# EAGLE design DualMax485 (EAGLE 9.6.2)
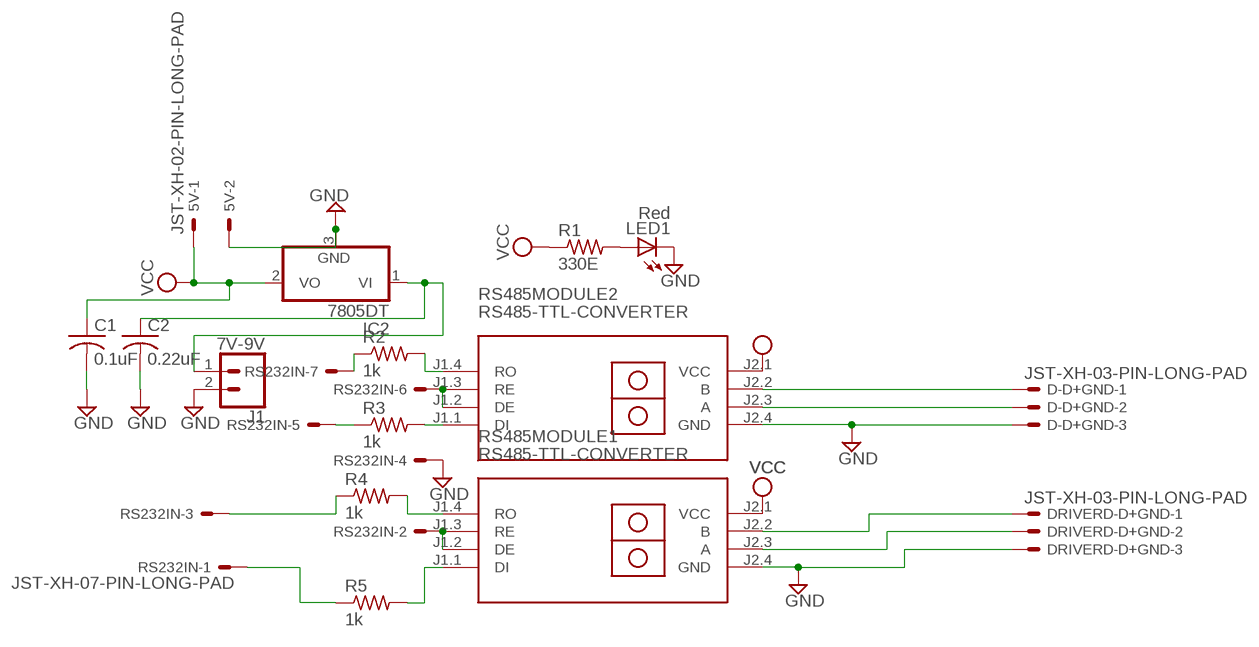
[diagram p0: schematic, sheet 1]

## Parts
5V  JST-XH-02-PIN-LONG-PAD  [JST-XH-02-PACKAGE-LONG-PAD]
C1  0.1uF  C-USC0805  [C0805]
C2  0.22uF  C-USC0805  [C0805]
D-D+GND  JST-XH-03-PIN-LONG-PAD  [JST-XH-03-PACKAGE-LONG-PAD]
DRIVERD-D+GND  JST-XH-03-PIN-LONG-PAD  [JST-XH-03-PACKAGE-LONG-PAD]
IC2  7805DT  [TO252]
J1  7V-9V  CONN_025MM  [SCREWTERMINAL-5MM-2]
LED1  Red  LEDCHIPLED_0805  [CHIPLED_0805]
R1  330E  R-US_M0805  [M0805]
R2  1k  R-US_M0805  [M0805]
R3  1k  R-US_M0805  [M0805]
R4  1k  R-US_M0805  [M0805]
R5  1k  R-US_M0805  [M0805]
RS232IN  JST-XH-07-PIN-LONG-PAD  [JST-XH-07-PACKAGE-LONG-PAD]
RS485MODULE1  RS485-TTL-CONVERTER  [RS485-TTL-CONVERTER]
RS485MODULE2  RS485-TTL-CONVERTER  [RS485-TTL-CONVERTER]

## Nets
GND: 5V.2 C1.2 C2.2 D-D+GND.3 DRIVERD-D+GND.3 IC2.3(GND) J1.2 LED1.C RS232IN.4 RS485MODULE1.J2.4(GND) RS485MODULE2.J2.4(GND)
N$1: RS232IN.6 RS485MODULE2.J1.2(DE) RS485MODULE2.J1.3(RE)
N$2: R3.2 RS485MODULE2.J1.1(DI)
N$3: R2.2 RS485MODULE2.J1.4(RO)
N$4: D-D+GND.1 RS485MODULE2.J2.2(B)
N$5: R3.1 RS232IN.5
N$6: D-D+GND.2 RS485MODULE2.J2.3(A)
N$7: RS232IN.2 RS485MODULE1.J1.2(DE) RS485MODULE1.J1.3(RE)
N$8: R5.1 RS232IN.1
N$9: LED1.A R1.2
N$10: R4.1 RS232IN.3
N$11: R2.1 RS232IN.7
N$12: DRIVERD-D+GND.1 RS485MODULE1.J2.2(B)
N$13: DRIVERD-D+GND.2 RS485MODULE1.J2.3(A)
N$14: R4.2 RS485MODULE1.J1.4(RO)
N$15: R5.2 RS485MODULE1.J1.1(DI)
N$16: C2.1 IC2.1(VI) J1.1
VCC: 5V.1 C1.1 IC2.2(VO) R1.1 RS485MODULE1.J2.1(VCC) RS485MODULE2.J2.1(VCC)

## Library data of the parts
5V = Rembrandt Electronics - JST XH Connectors v1-0:JST-XH-02-PIN: JST XH Connector 2 Pin Wire to board connector. Pitch: 2,54 mm, (0.100") Number of pins: 2 Created by Rembrandt Electronics www.rembrandtelectronics.com
C1 C2 = adafruit:C-US: CAPACITOR, American symbol
D-D+GND DRIVERD-D+GND = Rembrandt Electronics - JST XH Connectors v1-0:JST-XH-03-PIN: JST XH Connector 2 Pin Wire to board connector. Pitch: 2,54 mm, (0.100") Number of pins: 3 Created by Rembrandt Electronics www.rembrandtelectronics.com
IC2 = adafruit:78*: Positive VOLTAGE REGULATOR Added bigger pads to the TO-92 package
J1 = SparkFun-Connectors:CONN_02: Multi connection point. Often used as Generic Header-pin footprint for 0.1 inch spaced/style header connections On any of the 0.1 inch spaced packages, you can populate with these: Break Away Headers - Straight <https://www.sparkfun.com/products/116> (PRT-00116) Break Away Male Headers - Right Angle <https://www.sparkfun.com/products/553> (PRT-00553) Female Headers <https://www.sparkfun.com/products/115> (PRT-00115) Break Away Headers - Machine Pin <https://www.sparkfun.com/products/117> (PRT-00117) Break Away Female Headers - Swiss Machine Pin <https://www.sparkfun.com/products/743> (PRT-00743) For SCREWTERMINALS and SPRING TERMINALS visit here: Screw Terimnals on SparkFun.com <https://www.sparkfun.com/search/results?term=Screw+Terminals> (5mm/3.5mm/2.54mm spacing) This device is also useful as a general connection point to wire up your design to another part of your project. Our various solder wires solder well into these plated through hole pads. Hook-Up Wire - Assortment (Stranded, 22 AWG) <https://www.sparkfun.com/products/11375> (PRT-11375) Hook-Up Wire - Assortment (Solid Core, 22 AWG) <https://www.sparkfun.com/products/11367> (PRT-11367) View the entire wire category on our website here <https://www.sparkfun.com/categories/141> Special notes: Molex polarized connector foot print use with: PRT-08233 with associated crimp pins and housings. 2.54_SCREWTERM for use with PRT-10571. 3.5mm Screw Terminal footprints for PRT-08084 5mm Screw Terminal footprints for use with PRT-08432; SF_SKU: PRT-08432
LED1 = adafruit:LED: LED OSRAM: - CHIPLED LG R971, LG N971, LY N971, LG Q971, LY Q971, LO R971, LY R971 LH N974, LH R974 LS Q976, LO Q976, LY Q976 LO Q996 - Hyper CHIPLED LW Q18S LB Q993, LB Q99A, LB R99A - SideLED LS A670, LO A670, LY A670, LG A670, LP A670 LB A673, LV A673, LT A673, LW A673 LH A674 LY A675 LS A676, LA A676, LO A676, LY A676, LW A676 LS A679, LY A679, LG A679 - Hyper Micro SIDELED® LS Y876, LA Y876, LO Y876, LY Y876 LT Y87S - SmartLED LW L88C, LW L88S LB L89C, LB L89S, LG L890 LS L89K, LO L89K, LY L89K LS L896, LA L896, LO L896, LY L896 - TOPLED LS T670, LO T670, LY T670, LG T670, LP T670 LSG T670, LSP T670, LSY T670, LOP T670, LYG T670 LG T671, LOG T671, LSG T671 LB T673, LV T673, LT T673, LW T673 LH T674 LS T676, LA T676, LO T676, LY T676, LB T676, LH T676, LSB T676, LW T676 LB T67C, LV T67C, LT T67C, LS T67K, LO T67K, LY T67K, LW E67C LS E67B, LA E67B, LO E67B, LY E67B, LB E67C, LV E67C, LT E67C LW T67C LS T679, LY T679, LG T679 LS T770, LO T770, LY T770, LG T770, LP T770 LB T773, LV T773, LT T773, LW T773 LH T774 LS E675, LA E675, LY E675, LS T675 LS T776, LA T776, LO T776, LY T776, LB T776 LHGB T686 LT T68C, LB T68C - Hyper Mini TOPLED® LB M676 - Mini TOPLED Santana® LG M470 LS M47K, LO M47K, LY M47K Source: http://www.osram.convergy.de/
R1-R5 = adafruit:R-US_: RESISTOR, American symbol
RS232IN = Rembrandt Electronics - JST XH Connectors v1-0:JST-XH-07-PIN: JST XH Connector 2 Pin Wire to board connector. Pitch: 2,54 mm, (0.100") Number of pins: 7 Created by Rembrandt Electronics www.rembrandtelectronics.com
RS485MODULE1 RS485MODULE2 = diy-modules:RS485-TTL-CONVERTER: RS485 to TTL converter based on MAX485 chip

## Board
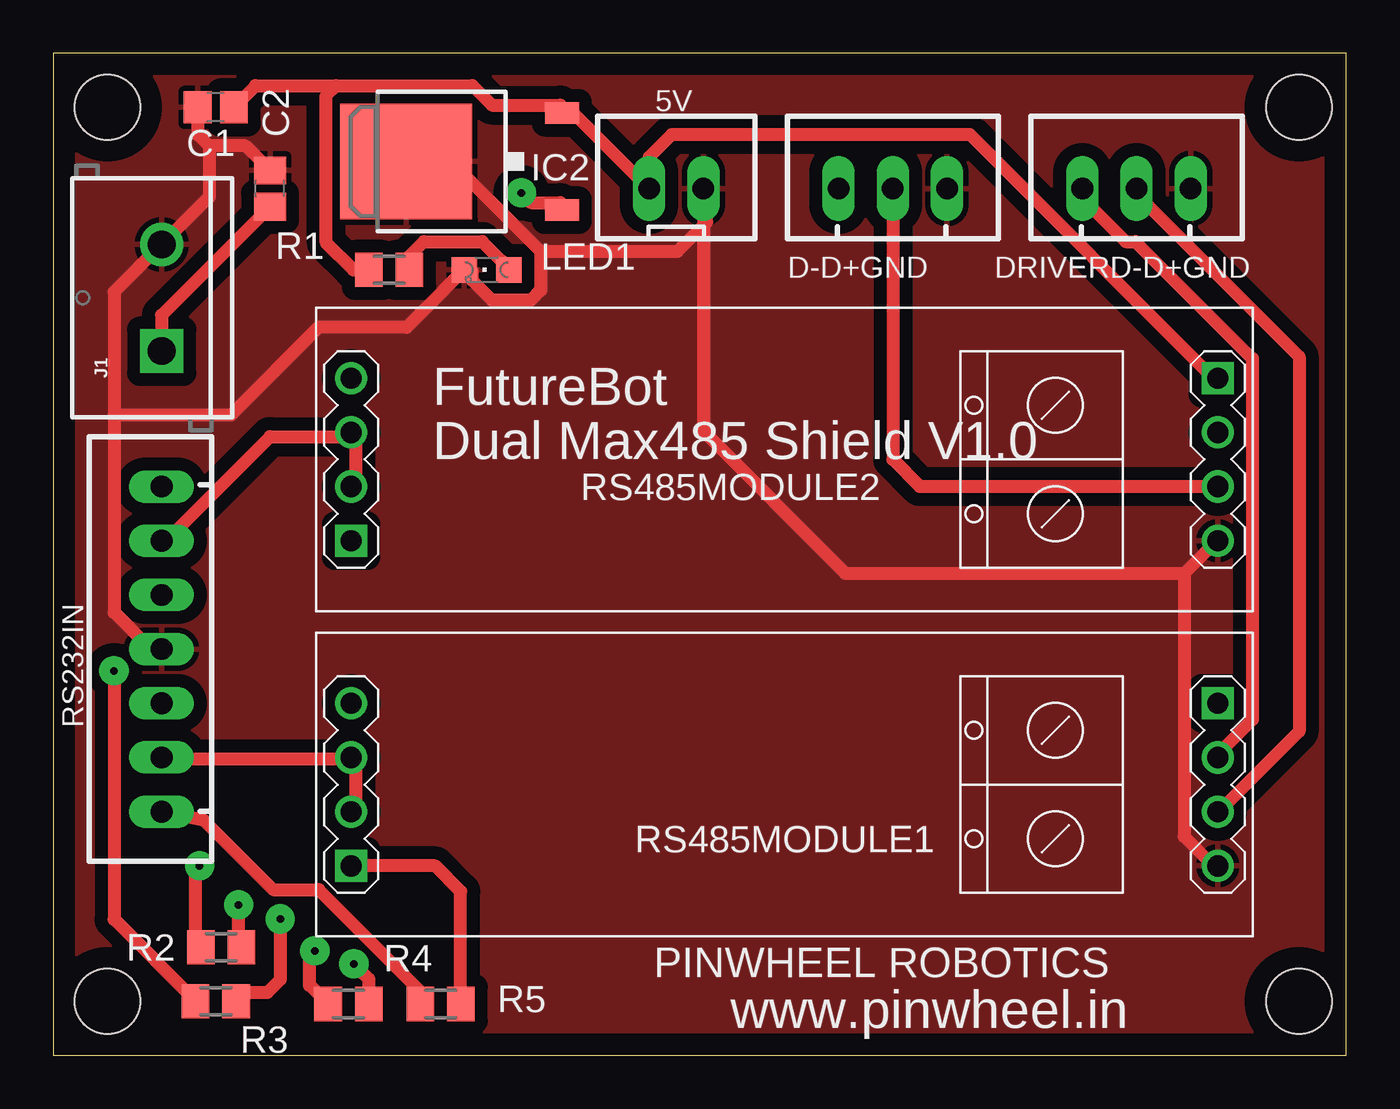
[diagram p1: board, top side]
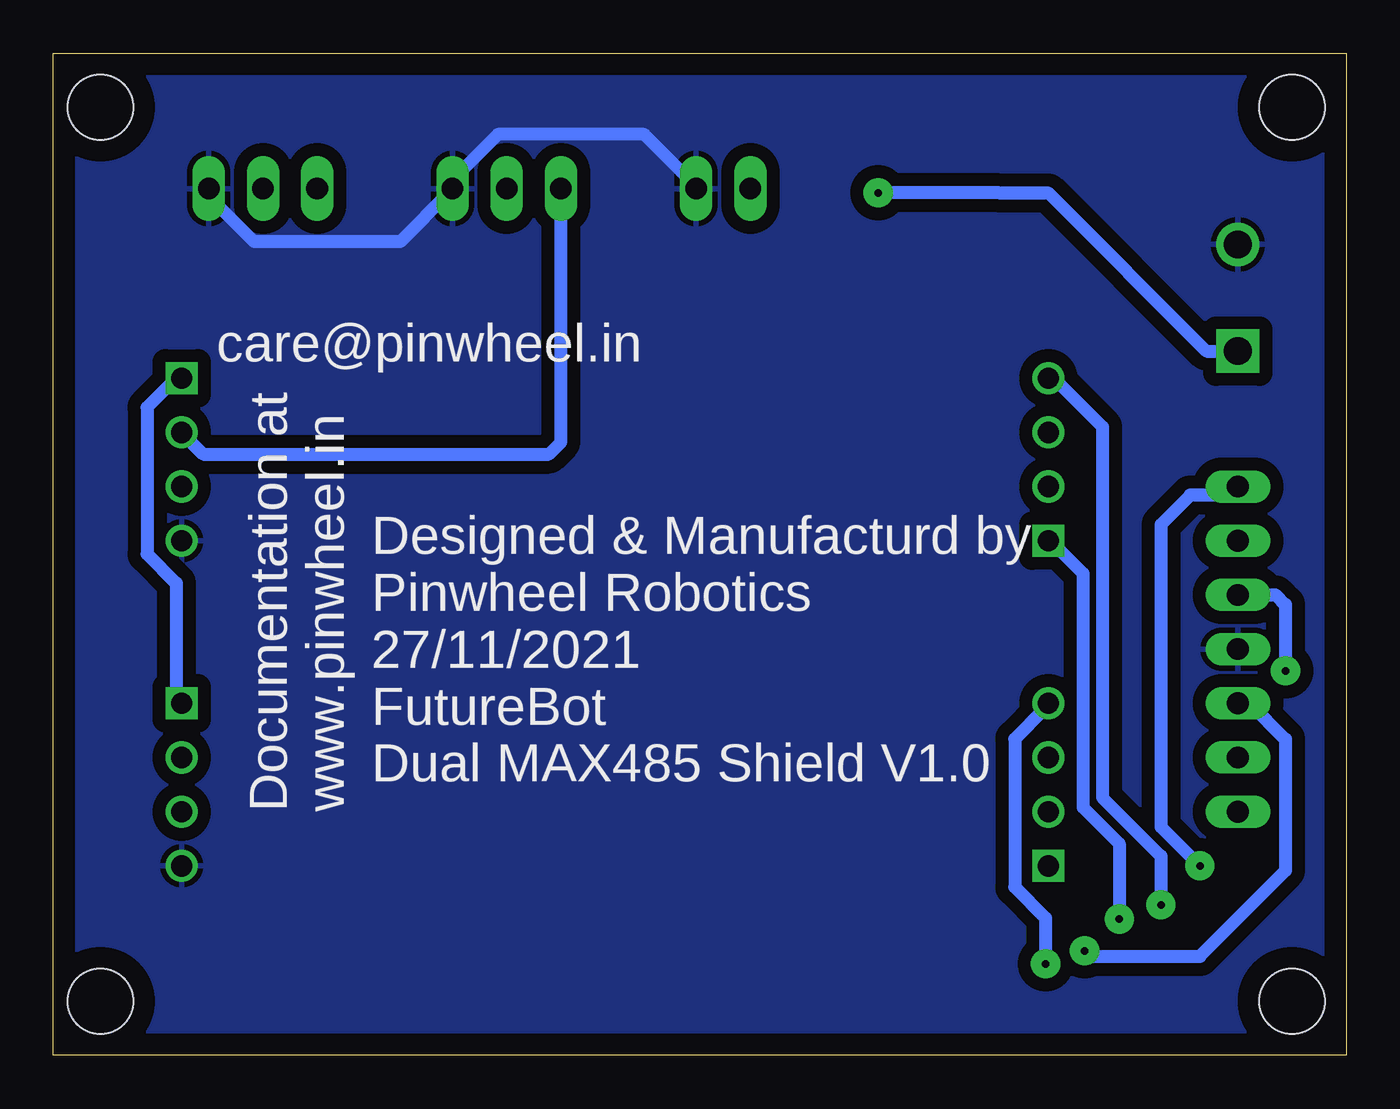
[diagram p2: board, bottom side, seen from below]

Size 60.63 x 46.98 mm. Coordinates in mm from the lower left corner, seen from the top.
Outline: 0,0 60.63,0 60.63,46.98 0,46.98 0,0
Copper layers (1*16): Top 0.035mm / dielectric 1.5mm / Bottom 0.035mm
Design rules "default *": minimum track width 24mil, minimum drill 0.35mm, track to track 12mil, track to pad 12mil, pad to pad 12mil, via to via 12mil, smd to smd 6mil, copper to edge 40mil, drill to drill 20mil, minimum pad ring 10mil, minimum via ring 20mil, stop-mask expansion 4mil, vias tented up to drill 0mil, thermal gap 10mil
Holes 3.05 mm at 2.54,44.45 2.54,2.54 58.42,44.45 58.42,2.54

### Footprints (pad centres in the part's own frame; a part is rotated, then mirrored left to right if it is on the bottom)
JST-XH-02-PACKAGE-LONG-PAD = drill 1.016 long: 1 -1.27,0; 2 1.27,0
C0805 = smd 1.3 x 1.5: 1 -0.85,0; 2 0.85,0
JST-XH-03-PACKAGE-LONG-PAD = drill 1.016 long: 1 -2.54,0; 2 0,0; 3 2.54,0
TO252 = smd 1 x 1.6: 1 -2.28,-4.8; 2 2.28,-4.8 | smd 5.4 x 6.2: 3 0,2.5
SCREWTERMINAL-5MM-2 = drill 1.3 pad 2.032 square: 1 0,0 | drill 1.3 pad 2.032: 2 5,0
CHIPLED_0805 = smd 1.2 x 1.2: A 0,-1.05; C 0,1.05
M0805 = smd 1.3 x 1.6: 1 -0.95,0; 2 0.95,0
JST-XH-07-PACKAGE-LONG-PAD = drill 1.016 long: 1 -7.62,0; 2 -5.08,0; 3 -2.54,0; 4 0,0; 5 2.54,0; 6 5.08,0; 7 7.62,0
RS485-TTL-CONVERTER = drill 1 square: J1.1 -20.32,-3.81; J2.1 20.32,3.81 | drill 1: J1.2 -20.32,-1.27; J1.3 -20.32,1.27; J1.4 -20.32,3.81; J2.2 20.32,1.27; J2.3 20.32,-1.27; J2.4 20.32,-3.81

### Placement (x,y rotation side)
5V  29.21,40.64 0 top
C1  7.62,44.45 180 top
C2  10.16,40.64 90 top
D-D+GND  39.37,40.64 0 top
DRIVERD-D+GND  50.8,40.64 0 top
IC2  19.05,41.91 90 top
J1  5.08,33.02 90 top
LED1  20.32,36.83 90 top
R1  15.75,36.83 0 top
R2  7.87,5.08 0 top
R3  7.62,2.54 0 top
R4  13.84,2.41 0 top
R5  18.16,2.41 0 top
RS232IN  5.08,19.05 90 top
RS485MODULE1  34.29,12.7 0 top
RS485MODULE2  34.29,27.94 0 top

### Tracks (layer width: path | path; a pad name or v marks a point on that pad's centre or on a via)
GND
  Top 0.61: RS232IN.4 4.57,19.05 2.85,20.78 2.85,30.02 | 2.85,30.02 2.85,35.79 J1.2 7.31,40.25 7.31,42.64 | 53.03,22.61 53.03,10.26 54.41,8.89 RS485MODULE1.J2.4 | 53.03,22.61 54.41,23.98 RS485MODULE2.J2.4 | 22.86,37.69 22.86,35.87 22.4,35.41 20.57,35.41 19.66,36.32 19.66,36.78 LED1.C 17.26,34.82 17.25,34.82 16.56,34.14 12.45,34.14 8.33,30.02 2.85,30.02 | 22.86,37.69 18.75,41.81 16.92,41.81 IC2.3 | 22.86,37.69 29.26,37.69 30.63,39.07 30.63,40.49 5V.2 30.48,29.26 37.13,22.61 53.03,22.61 | C1.2 6.77,43.18 7.31,42.64 | C2.2 9.01,42.64 7.31,42.64
  Bottom 0.61: 5V.2 30.63,40.89 32.92,43.18 39.78,43.18 41.6,41.35 41.6,40.89 D-D+GND.3 42.06,40.44 44.35,38.15 51.21,38.15 53.03,39.98 53.03,40.44 DRIVERD-D+GND.3
  pour Top (isolate 0.61): 0,46.99 60.96,46.99 60.96,0 0,0
  pour Bottom (isolate 0.61): 0,46.99 60.96,46.99 60.96,0 0,0
N$1
  Top 0.61: RS232IN.6 5.14,24.19 5.45,24.3 10.16,29.01 13.72,29.01 RS485MODULE2.J1.3 14.17,29.01 14.17,26.72 RS485MODULE2.J1.2
N$2  (via drill 0.35)
  Top 0.61: v10.64,6.4 10.64,3.56 10.03,2.95 8.69,2.95 R3.2
  Bottom 0.61: v10.64,6.4 10.64,9.93 12.34,11.63 12.34,22.61 13.72,23.98 RS485MODULE2.J1.1
N$3  (via drill 0.35)
  Top 0.61: R2.2 8.69,5.22 v8.69,7.06
  Bottom 0.61: v8.69,7.06 8.69,9.35 11.43,12.09 11.43,29.46 13.72,31.75 RS485MODULE2.J1.4
N$4
  Bottom 0.61: RS485MODULE2.J2.2 53.59,28.19 37.39,28.19 36.83,28.75 D-D+GND.1
N$5  (via drill 0.35)
  Top 0.61: R3.1 2.85,6.38 v2.85,18.03
  Bottom 0.61: v2.85,18.03 2.85,21.13 3.3,21.59 RS232IN.5
N$6
  Top 0.61: D-D+GND.2 39.37,27.94 40.64,26.67 RS485MODULE2.J2.3
N$7
  Top 0.61: RS232IN.2 5.13,13.92 13.72,13.92 RS485MODULE1.J1.3 14.17,13.92 14.17,11.63 RS485MODULE1.J1.2
N$8
  Top 0.61: RS232IN.1 7.05,11.04 10.31,7.77 12.45,7.77 17.21,3.01 R5.1
N$9
  Top 0.61: LED1.A 21.03,37.24 20.12,38.15 17.37,38.15 16.46,37.24 16.66,37.03 16.66,36.86 R1.2
N$10  (via drill 0.35)
  Top 0.61: v12.27,4.9 12.01,4.65 12.01,3.29 R4.1
  Bottom 0.61: v12.27,4.9 12.27,4.65 6.86,4.65 2.85,8.66 2.85,14.83 4.52,16.51 RS232IN.3
N$11  (via drill 0.35)
  Top 0.61: v6.86,8.89 6.68,8.71 6.68,5.33 R2.1
  Bottom 0.61: v6.86,8.89 8.69,10.72 8.69,24.89 7.32,26.26 5.13,26.26 RS232IN.7
N$12
  Top 0.61: RS485MODULE1.J2.2 54.86,14.38 56.24,15.75 56.24,32.66 50.75,38.15 50.29,38.15 48.01,40.44 DRIVERD-D+GND.1
N$13
  Top 0.61: RS485MODULE1.J2.3 54.86,11.63 58.42,15.19 58.42,32.77 51.21,39.98 51.21,40.44 DRIVERD-D+GND.2
N$14  (via drill 0.35)
  Top 0.61: v14.1,4.29 14.79,3.6 R4.2
  Bottom 0.61: v14.1,4.29 14.1,6.45 15.54,7.9 15.54,14.83 14.17,16.2 RS485MODULE1.J1.4
N$15
  Top 0.61: R5.2 19.11,7.69 17.91,8.89 RS485MODULE1.J1.1
N$16  (via drill 0.35)
  Top 0.61: v21.95,40.44 22.4,39.98 23.77,39.98 IC2.1 | C2.1 5.08,34.71 J1.1
  Bottom 0.61: v21.95,40.44 16.26,40.44 13.97,40.44 6.55,33.02 J1.1
VCC
  Top 0.61: 13.26,45.47 19.66,45.47 20.57,44.55 23.77,44.55 IC2.2 23.77,44.09 23.77,44.25 24.33,44.25 5V.1 27.94,42.11 29.01,43.18 42.98,43.18 54.41,31.75 RS485MODULE2.J2.1 | 13.26,45.47 12.8,45.01 12.8,38.1 14.07,36.83 R1.1 | C1.1 9.49,45.47 13.26,45.47
  Bottom 0.61: RS485MODULE1.J2.1 54.86,16.66 54.86,22.15 56.24,23.52 56.24,30.38 54.86,31.75 RS485MODULE2.J2.1

### Text on the board
tNames: FutureBot | Dual Max485 Shield V1.0 | PINWHEEL ROBOTICS | www.pinwheel.in
bNames: care@pinwheel.in | Documentation at / www.pinwheel.in | Designed & Manufacturd by / Pinwheel Robotics / 27/11/2021 / FutureBot / Dual MAX485 Shield V1.0